# EAGLE design usb-rs485 (EAGLE 6.4)
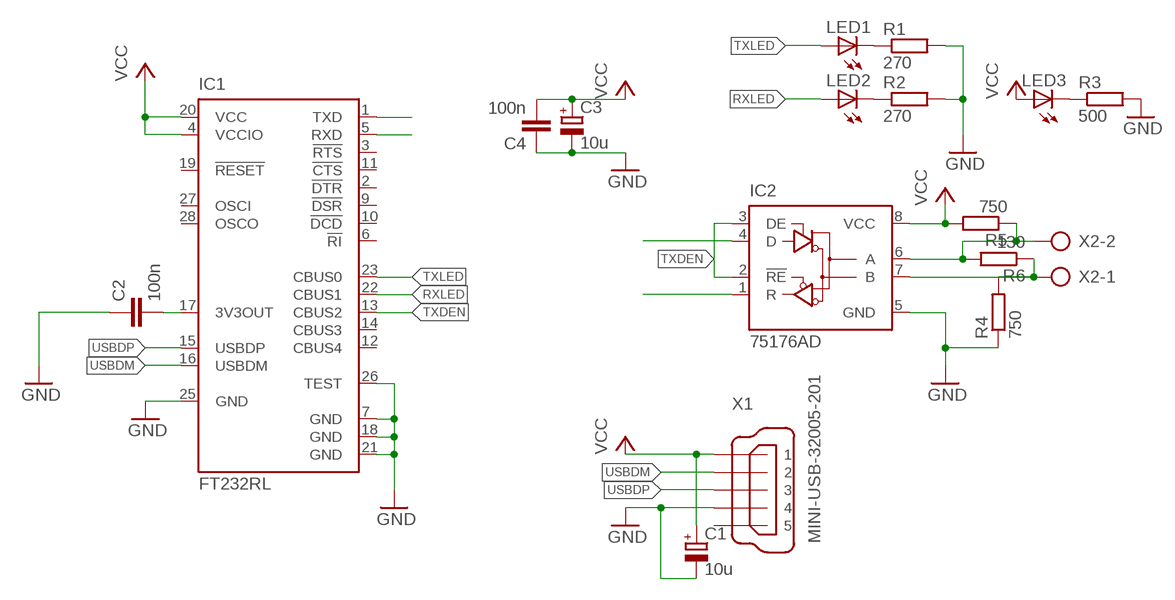
[diagram p0: schematic, sheet 1]

## Parts
C1  10u  CPOL-EUD  [PANASONIC_D]
C2  100n  C-EUC0805  [C0805]
C3  10u  CPOL-EUD  [PANASONIC_D]
C4  100n  C-EUC0805  [C0805]
IC1  FT232RL  [SSOP28]
IC2  75176AD  [D_R-PDSO-G8]
LED1  LEDSML0805  [SML0805]
LED2  LEDSML0805  [SML0805]
LED3  LEDSML0805  [SML0805]
R1  270  R-EU_R0805  [R0805]
R2  270  R-EU_R0805  [R0805]
R3  500  R-EU_R0805  [R0805]
R4  750  R-EU_R0805  [R0805]
R5  750  R-EU_R0805  [R0805]
R6  130  R-EU_R0805  [R0805]
X1  MINI-USB-32005-201  [32005-201]
X2  AK300/2  [AK300/2]

## Nets
GND: C1.- C2.1 C3.- C4.1 IC1.7(GND) IC1.18(GND) IC1.21(GND) IC1.25(GND) IC1.26(TEST) IC2.5(GND) R1.2 R2.2 R3.2 R4.1 X1.4
N$1: LED1.C R1.1
N$2: LED2.C R2.1
N$3: C2.2 IC1.17(3V3OUT)
N$4: LED3.C R3.1
N$9: IC2.6(A) R5.1 R6.2 X2.2
N$10: IC2.7(B) R4.2 R6.1 X2.1
RX: IC1.5(RXD) IC2.1(R)
RXLED: IC1.22(CBUS1) LED2.A
TX: IC1.1(TXD) IC2.4(D)
TXDEN: IC1.13(CBUS2) IC2.2(!RE) IC2.3(DE)
TXLED: IC1.23(CBUS0) LED1.A
USBDM: IC1.16(USBDM) X1.2
USBDP: IC1.15(USBDP) X1.3
VCC: C1.+ C3.+ C4.2 IC1.4(VCCIO) IC1.20(VCC) IC2.8(VCC) LED3.A R5.2 X1.1
Unconnected: IC1.2(!DTR) IC1.3(!RTS) IC1.6(!RI) IC1.9(!DSR) IC1.10(!DCD) IC1.11(!CTS) IC1.12(CBUS4) IC1.14(CBUS3) IC1.19(!RESET) IC1.27(OSCI) IC1.28(OSCO) X1.5

## Library data of the parts
C1 C3 = rcl:CPOL-EU: POLARIZED CAPACITOR, European symbol
C2 C4 = rcl:C-EU: CAPACITOR, European symbol
IC1 = ftdichip:FT232R: Source: http://www.ftdichip.com/Documents/DataSheets/DS_FT232R_v104.pdf; MPN: FT232RL; OC_FARNELL: 1146032; OC_NEWARK: 91K9918
IC2 = 751xx:75176A: DIFFERENTIAL BUS TRANSCEIVER Source: http://focus.ti.com/lit/ds/symlink/sn75176a.pdf
LED1-LED3 = led:LED: LED OSRAM: - CHIPLED LG R971, LG N971, LY N971, LG Q971, LY Q971, LO R971, LY R971 LH N974, LH R974 LS Q976, LO Q976, LY Q976 LO Q996 - Hyper CHIPLED LW Q18S LB Q993, LB Q99A, LB R99A - SideLED LS A670, LO A670, LY A670, LG A670, LP A670 LB A673, LV A673, LT A673, LW A673 LH A674 LY A675 LS A676, LA A676, LO A676, LY A676, LW A676 LS A679, LY A679, LG A679 - Hyper Micro SIDELED® LS Y876, LA Y876, LO Y876, LY Y876 LT Y87S - SmartLED LW L88C, LW L88S LB L89C, LB L89S, LG L890 LS L89K, LO L89K, LY L89K LS L896, LA L896, LO L896, LY L896 - TOPLED LS T670, LO T670, LY T670, LG T670, LP T670 LSG T670, LSP T670, LSY T670, LOP T670, LYG T670 LG T671, LOG T671, LSG T671 LB T673, LV T673, LT T673, LW T673 LH T674 LS T676, LA T676, LO T676, LY T676, LB T676, LH T676, LSB T676, LW T676 LB T67C, LV T67C, LT T67C, LS T67K, LO T67K, LY T67K, LW E67C LS E67B, LA E67B, LO E67B, LY E67B, LB E67C, LV E67C, LT E67C LW T67C LS T679, LY T679, LG T679 LS T770, LO T770, LY T770, LG T770, LP T770 LB T773, LV T773, LT T773, LW T773 LH T774 LS E675, LA E675, LY E675, LS T675 LS T776, LA T776, LO T776, LY T776, LB T776 LHGB T686 LT T68C, LB T68C - Hyper Mini TOPLED® LB M676 - Mini TOPLED Santana® LG M470 LS M47K, LO M47K, LY M47K Source: http://www.osram.convergy.de LUXEON: - LUMILED® LXK2-PW12-R00, LXK2-PW12-S00, LXK2-PW14-U00, LXK2-PW14-V00 LXK2-PM12-R00, LXK2-PM12-S00, LXK2-PM14-U00 LXK2-PE12-Q00, LXK2-PE12-R00, LXK2-PE12-S00, LXK2-PE14-T00, LXK2-PE14-U00 LXK2-PB12-K00, LXK2-PB12-L00, LXK2-PB12-M00, LXK2-PB14-N00, LXK2-PB14-P00, LXK2-PB14-Q00 LXK2-PR12-L00, LXK2-PR12-M00, LXK2-PR14-Q00, LXK2-PR14-R00 LXK2-PD12-Q00, LXK2-PD12-R00, LXK2-PD12-S00 LXK2-PH12-R00, LXK2-PH12-S00 LXK2-PL12-P00, LXK2-PL12-Q00, LXK2-PL12-R00 Source: www.luxeon.com KINGBRIGHT: KA-3528ASYC Source: www.kingbright.com
R1-R6 = rcl:R-EU_: RESISTOR, European symbol
X1 = con-cypressindustries:MINI-USB-: MINI USB-B Conector Source: www.cypressindustries.com; OC_FARNELL: unknown; OC_NEWARK: unknown
X2 = con-ptr500:AK300/2: CONNECTOR; OC_FARNELL: unknown; OC_NEWARK: unknown

## Board
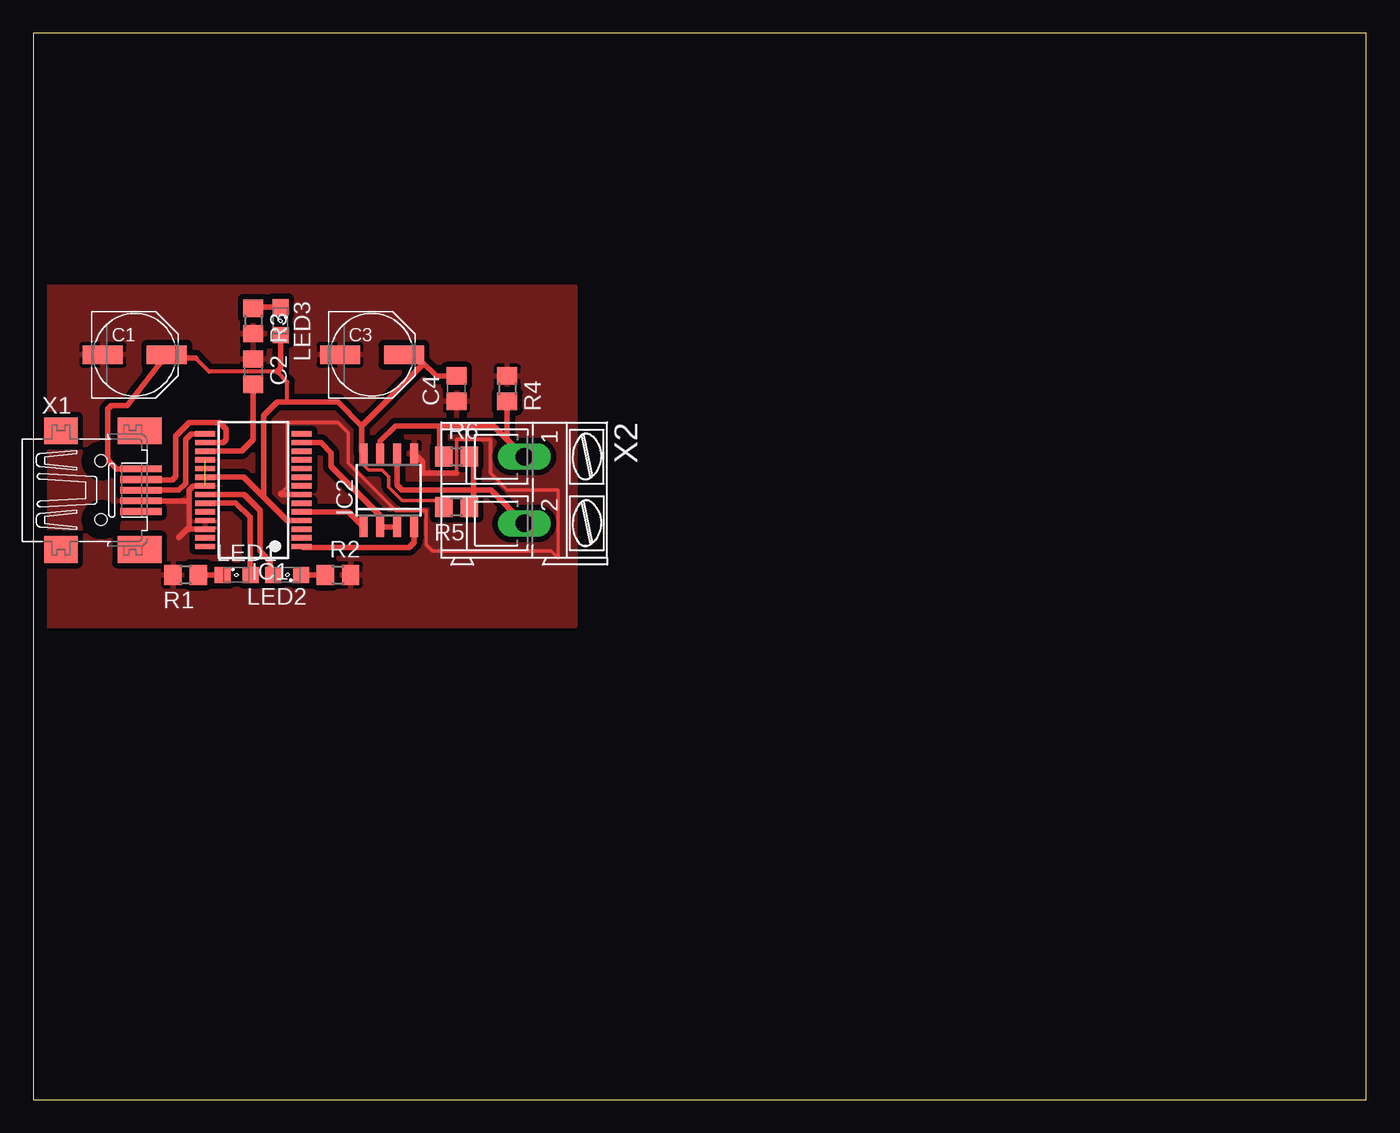
[diagram p1: board, top side]

Size 100 x 80 mm. Coordinates in mm from the lower left corner, seen from the top.
Outline: 0,0 100,0 100,80 0,80 0,0
Copper layers (1*16): Top 0.035mm / dielectric 1.5mm / Bottom 0.035mm
Design rules "default": minimum track width 10mil, minimum drill 24mil, track to track 8mil, track to pad 8mil, pad to pad 8mil, via to via 8mil, smd to smd 8mil, copper to edge 40mil, drill to drill 8mil, minimum pad ring 10mil, minimum via ring 8mil, stop-mask expansion 4mil, vias tented up to drill 0mil, thermal gap 10mil

### Footprints (pad centres in the part's own frame; a part is rotated, then mirrored left to right if it is on the bottom)
PANASONIC_D = smd 3 x 1.4: + 2.4,0; - -2.4,0
C0805 = smd 1.3 x 1.5: 1 -0.95,0; 2 0.95,0
SSOP28 = smd 0.4 x 1.5: 1 -4.225,-3.625; 2 -3.575,-3.625; 3 -2.925,-3.625; 4 -2.275,-3.625; 5 -1.625,-3.625; 6 -0.975,-3.625; 7 -0.325,-3.625; 8 0.325,-3.625; 9 0.975,-3.625; 10 1.625,-3.625; 11 2.275,-3.625; 12 2.925,-3.625; 13 3.575,-3.625; 14 4.225,-3.625; 15 4.225,3.625; 16 3.575,3.625; 17 2.925,3.625; 18 2.275,3.625; 19 1.625,3.625; 20 0.975,3.625; 21 0.325,3.625; 22 -0.325,3.625; 23 -0.975,3.625; 24 -1.625,3.625; 25 -2.275,3.625; 26 -2.925,3.625; 27 -3.575,3.625; 28 -4.225,3.625
D_R-PDSO-G8 = smd 0.6 x 1.5: 1 -1.905,-2.75; 2 -0.635,-2.75; 3 0.635,-2.75; 4 1.905,-2.75; 5 1.905,2.75; 6 0.635,2.75; 7 -0.635,2.75; 8 -1.905,2.75
SML0805 = smd 1.2 x 1.2: A 1.05,0; C -1.05,0
R0805 = smd 1.3 x 1.5: 1 -0.95,0; 2 0.95,0
32005-201 = smd 3.1 x 0.5: 1 3,1.6; 2 3,0.8; 3 3,0; 4 3,-0.8; 5 3,-1.6 | smd 2.5 x 2: M1 -3,-4.45; M2 -3,4.45 | smd 3.3 x 2: M3 2.9,4.45; M4 2.9,-4.45 | hole 0.9: 0,2.2; 0,-2.2
AK300/2 = drill 1.321 long: 1 -2.515,0; 2 2.489,0

### Placement (x,y rotation side)
C1  7.62,55.88 0 top
C2  16.51,54.61 270 top
C3  25.4,55.88 0 top
C4  31.75,53.34 90 top
IC1  16.51,45.72 90 top
IC2  26.67,45.72 0 top
LED1  15.24,39.37 0 top
LED2  19.05,39.37 180 top
LED3  18.54,58.42 270 top
R1  11.43,39.37 180 top
R2  22.86,39.37 0 top
R3  16.51,58.42 270 top
R4  35.56,53.34 270 top
R5  31.75,44.45 180 top
R6  31.75,48.26 0 top
X1  5.08,45.72 0 top
X2  36.83,45.72 270 top

### Tracks (layer width: path | path; a pad name or v marks a point on that pad's centre or on a via)
GND  (1 unrouted)
  Top 0.254: 18.54,45.47 19.05,45.97 19.05,50.8 22.86,50.8 23.62,50.04 23.62,47.75 27.18,44.2 29.46,44.2 29.46,41.66 29.97,41.15 38.86,41.15 39.37,40.64 39.37,45.72 35.56,45.72 34.29,46.99 34.29,49.53 31.75,49.53 31.75,46.99
  Top 0.406: IC1.7 18.61,45.4 18.54,45.47 | IC1.26 11.55,42.8 | 11.55,42.8 10.92,42.16 | IC1.21 12.01,46.05 11.68,45.72 11.68,44.7 | 11.68,44.7 11.68,42.93 11.55,42.8 | X1.4 11.47,44.92 11.68,44.7 | IC2.5 29.21,47.84 29.21,46.99 31.75,46.99
  pour Top (isolate 0.406): 0,60.96 40.64,60.96 40.64,35.56 0,35.56
N$1
  Top 0.406: LED1.C R1.1
N$2
  Top 0.406: LED2.C R2.1
N$3
  Top 0.406: C2.2 16.51,49.53 15.62,48.65 IC1.17
N$4
  Top 0.406: LED3.C 16.61,59.47 R3.1
N$9
  Top 0.406: X2.2 34.34,45.72 33.02,45.72 | 33.02,45.72 27.69,45.72 27.3,46.1 IC2.6 | R6.2 33.02,48.26 33.02,45.72 | R5.1 33.02,44.45 33.02,45.72
N$10
  Top 0.406: X2.1 35.55,49.52 | 35.55,49.52 34.52,50.55 30.48,50.55 | 30.48,50.55 27.18,50.55 26.04,49.4 IC2.7 | R4.2 35.55,52.39 35.55,49.52 | R6.1 30.48,48.26 30.48,50.55
RX
  Top 0.406: IC2.1 23.64,44.09 IC1.5
RXLED
  Top 0.406: LED2.A 17.78,39.59 17.78,40.39 17.02,41.15 17.02,44.2 15.82,45.4 IC1.22
TX
  Top 0.406: IC2.4 28.57,41.78 28.19,41.4 20.23,41.4 IC1.1
TXDEN
  Top 0.406: IC2.3 IC2.2 26.04,43.81 22.35,47.5 22.35,48.51 21.59,49.28 20.15,49.28 IC1.13
TXLED
  Top 0.406: LED1.A 16.26,39.4 16.26,43.69 15.2,44.74 IC1.23
USBDM
  Top 0.406: IC1.16 14.24,49.3 14.48,49.53 14.48,50.29 13.97,50.8 11.68,50.8 10.67,49.78 10.67,46.74 10.41,46.48 8.12,46.48 X1.2
USBDP
  Top 0.406: IC1.15 11.85,49.95 11.43,49.53 11.43,46.23 10.92,45.72 X1.3
VCC
  Top 0.254: R5.2 30.29,44.96 27.69,44.96 26.67,45.97 26.67,46.74 26.16,47.24 25.15,47.24 24.77,47.62 IC2.8
  Top 0.305: 19.05,52.32 19.05,53.85 18.29,54.61 13.21,54.61 12.19,55.63
  Top 0.406: C3.+ 29.18,55.35 | 29.18,55.35 30.24,54.29 C4.2 | IC2.8 24.64,48.6 24.64,50.55 | 24.64,50.55 29.18,55.09 29.18,55.35 | 17.27,45.21 19.04,43.45 IC1.4 | 24.64,50.55 22.86,52.32 19.05,52.32 18.29,52.32 17.27,51.31 17.27,45.21 | IC1.20 15.79,46.7 17.27,45.21 | 12.19,55.63 10.62,55.63 C1.+ 7.06,52.07 5.84,52.07 5.59,51.82 5.59,48.01 6.27,47.32 X1.1 | LED3.A 18.54,54.86 18.29,54.61